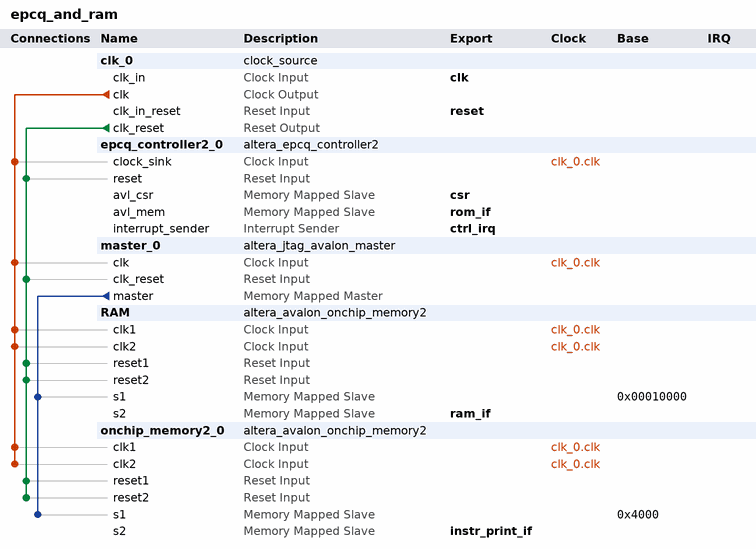
[diagram p0: system contents]
# Platform Designer (Qsys) system epcq_and_ram, Cyclone 10 LP 10CL025YU256I7G
# Parameters at their usual value, and those the tool derives, are not listed.
package require -exact qsys 19.1
create_system epcq_and_ram
set_project_property DEVICE_FAMILY {Cyclone 10 LP}
set_project_property DEVICE 10CL025YU256I7G

add_instance clk_0 clock_source 19.1
set_instance_parameter_value clk_0 clockFrequency 50000000

add_instance epcq_controller2_0 altera_epcq_controller2 19.1
set_instance_parameter_value epcq_controller2_0 CHIP_SELS 1
set_instance_parameter_value epcq_controller2_0 DDASI 0
set_instance_parameter_value epcq_controller2_0 FLASH_TYPE EPCQ128A
set_instance_parameter_value epcq_controller2_0 IO_MODE STANDARD
set_instance_parameter_value epcq_controller2_0 clkFreq 50000000

add_instance master_0 altera_jtag_avalon_master 19.1

add_instance RAM altera_avalon_onchip_memory2 19.1
set_instance_parameter_value RAM dataWidth 32
set_instance_parameter_value RAM dualPort true
set_instance_parameter_value RAM initMemContent false
set_instance_parameter_value RAM initializationFileName onchip_mem.hex
set_instance_parameter_value RAM memorySize 10000
set_instance_parameter_value RAM resetrequest_enabled false

add_instance onchip_memory2_0 altera_avalon_onchip_memory2 19.1
set_instance_parameter_value onchip_memory2_0 dataWidth 32
set_instance_parameter_value onchip_memory2_0 dualPort true
set_instance_parameter_value onchip_memory2_0 initMemContent true
set_instance_parameter_value onchip_memory2_0 initializationFileName onchip_mem.hex
set_instance_parameter_value onchip_memory2_0 memorySize 4096

# connections
add_connection clk_0.clk epcq_controller2_0.clock_sink clock
add_connection clk_0.clk master_0.clk clock
add_connection clk_0.clk onchip_memory2_0.clk1 clock
add_connection clk_0.clk onchip_memory2_0.clk2 clock
add_connection clk_0.clk RAM.clk1 clock
add_connection clk_0.clk RAM.clk2 clock
add_connection clk_0.clk_reset epcq_controller2_0.reset reset
add_connection clk_0.clk_reset master_0.clk_reset reset
add_connection clk_0.clk_reset onchip_memory2_0.reset1 reset
add_connection clk_0.clk_reset onchip_memory2_0.reset2 reset
add_connection clk_0.clk_reset RAM.reset1 reset
add_connection clk_0.clk_reset RAM.reset2 reset
add_connection master_0.master onchip_memory2_0.s1 avalon
set_connection_parameter_value master_0.master/onchip_memory2_0.s1 baseAddress 0x4000
add_connection master_0.master RAM.s1 avalon
set_connection_parameter_value master_0.master/RAM.s1 baseAddress 0x00010000

# exported interfaces
add_interface clk clock sink
set_interface_property clk EXPORT_OF clk_0.clk_in
add_interface csr avalon slave
set_interface_property csr EXPORT_OF epcq_controller2_0.avl_csr
add_interface ctrl_irq interrupt sender
set_interface_property ctrl_irq EXPORT_OF epcq_controller2_0.interrupt_sender
add_interface instr_print_if avalon slave
set_interface_property instr_print_if EXPORT_OF onchip_memory2_0.s2
add_interface ram_if avalon slave
set_interface_property ram_if EXPORT_OF RAM.s2
add_interface reset reset sink
set_interface_property reset EXPORT_OF clk_0.clk_in_reset
add_interface rom_if avalon slave
set_interface_property rom_if EXPORT_OF epcq_controller2_0.avl_mem

set_interconnect_requirement {$system} qsys_mm.clockCrossingAdapter HANDSHAKE
set_interconnect_requirement {$system} qsys_mm.enableEccProtection FALSE
set_interconnect_requirement {$system} qsys_mm.insertDefaultSlave FALSE
set_interconnect_requirement {$system} qsys_mm.maxAdditionalLatency 1

save_system epcq_and_ram.qsys
